# Altium project DAQ_Module.PrjPcb
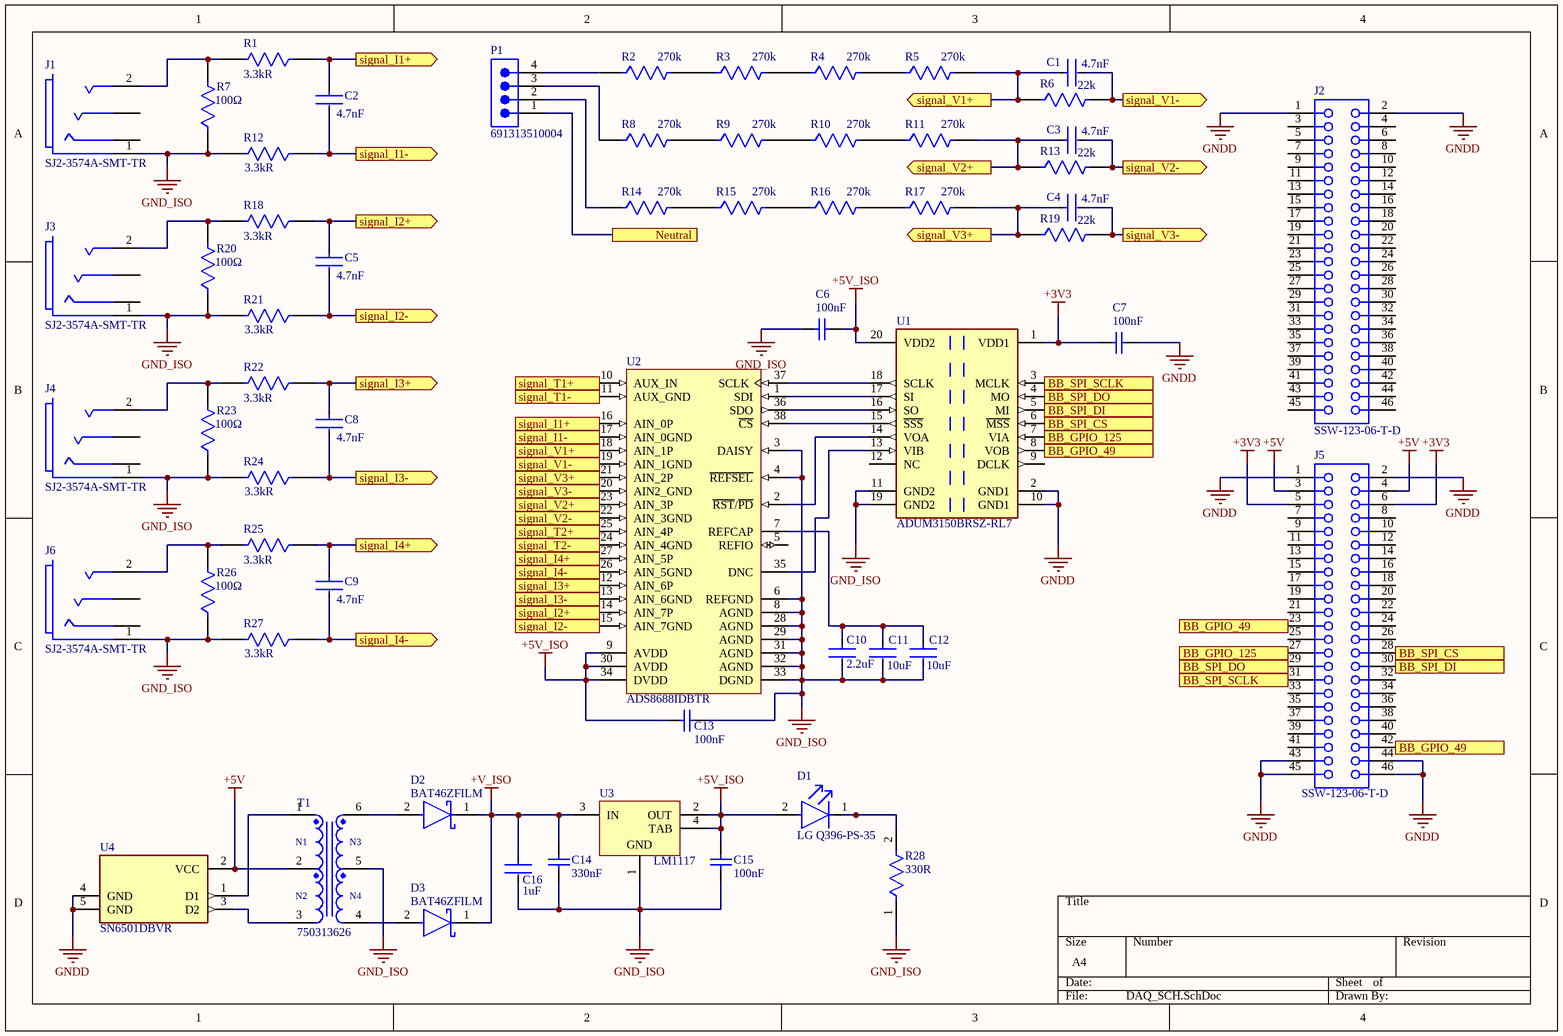
[diagram p0: DAQ_SCH.SchDoc]
Designer: Gabriel Canela; ProjectDescription: DAQ_Module for SH-Analyzer; ProjectStartDate: 06/10/2025
1 sheet, 59 parts. Net scope: flat (ports and power ports of the same name join across sheets).
Board file: DAQ_PCB.PcbDoc

## Sheet DAQ_SCH.SchDoc
size A4; SheetNumber: 1; SheetTotal: 1

### Parts
C1  Capacitance: 4.7nF  [FP-GCD188-0_1-MFG]  (hidden comment: GCD188R71H472KA01D)
C2  Capacitance: 4.7nF  [FP-GCD188-0_1-MFG]  (hidden comment: GCD188R71H472KA01D)
C3  Capacitance: 4.7nF  [FP-GCD188-0_1-MFG]  (hidden comment: GCD188R71H472KA01D)
C4  Capacitance: 4.7nF  [FP-GCD188-0_1-MFG]  (hidden comment: GCD188R71H472KA01D)
C5  Capacitance: 4.7nF  [FP-GCD188-0_1-MFG]  (hidden comment: GCD188R71H472KA01D)
C6  100nF  [CAPC2013X145X50NL20T25]
C7  100nF  [CAPC2013X145X50NL20T25]
C8  Capacitance: 4.7nF  [FP-GCD188-0_1-MFG]  (hidden comment: GCD188R71H472KA01D)
C9  Capacitance: 4.7nF  [FP-GCD188-0_1-MFG]  (hidden comment: GCD188R71H472KA01D)
C10  2.2uF  [FP-ZRB155-0_2-MFG]
C11  10uF  [FP-GRM155-0_2-MFG]
C12  10uF  [FP-GRM155-0_2-MFG]
C13  100nF  [CAPC2013X145X50NL20T25]
C14  330nF  [CAPC1608X90X35NL15T15]
C15  100nF  [CAPC2013X145X50NL20T25]
C16  1uF  [FP-CGA3E-0_3-0_1-IPC_B]
D1  LG Q396-PS-35  [FP-LG_Q396-MFG]
D2  BAT46ZFILM  [FP-SOD-123-MFG]
D3  BAT46ZFILM  [FP-SOD-123-MFG]
J1  SJ2-3574A-SMT-TR  [FP-SJ2-3574A-SMT-TR-MFG]
J2  SSW-123-06-T-D  [SMTC-SSW-123-06-X-D]
J3  SJ2-3574A-SMT-TR  [FP-SJ2-3574A-SMT-TR-MFG]
J4  SJ2-3574A-SMT-TR  [FP-SJ2-3574A-SMT-TR-MFG]
J5  SSW-123-06-T-D  [SMTC-SSW-123-06-X-D]
J6  SJ2-3574A-SMT-TR  [FP-SJ2-3574A-SMT-TR-MFG]
P1  691313510004  [691313510004]
R1  Resistance: 3.3kR  [FP-CRCW0603-HPe3-MFG]  (hidden comment: CRCW06033K30FKECHP)
R2  270k  [FP-CRGCQ1210-IPC_C]
R3  270k  [FP-CRGCQ1210-IPC_C]
R4  270k  [FP-CRGCQ1210-IPC_C]
R5  270k  [FP-CRGCQ1210-IPC_C]
R6  22k  [FP-ESR10-IPC_C]
R7  value 100Ω  [FP-CRGCQ0603-IPC_C]  (hidden comment: CRGCQ0603F100R)
R8  270k  [FP-CRGCQ1210-IPC_C]
R9  270k  [FP-CRGCQ1210-IPC_C]
R10  270k  [FP-CRGCQ1210-IPC_C]
R11  270k  [FP-CRGCQ1210-IPC_C]
R12  Resistance: 3.3kR  [FP-CRCW0603-HPe3-MFG]  (hidden comment: CRCW06033K30FKECHP)
R13  22k  [FP-ESR10-IPC_C]
R14  270k  [FP-CRGCQ1210-IPC_C]
R15  270k  [FP-CRGCQ1210-IPC_C]
R16  270k  [FP-CRGCQ1210-IPC_C]
R17  270k  [FP-CRGCQ1210-IPC_C]
R18  Resistance: 3.3kR  [FP-CRCW0603-HPe3-MFG]  (hidden comment: CRCW06033K30FKECHP)
R19  22k  [FP-ESR10-IPC_C]
R20  value 100Ω  [FP-CRGCQ0603-IPC_C]  (hidden comment: CRGCQ0603F100R)
R21  Resistance: 3.3kR  [FP-CRCW0603-HPe3-MFG]  (hidden comment: CRCW06033K30FKECHP)
R22  Resistance: 3.3kR  [FP-CRCW0603-HPe3-MFG]  (hidden comment: CRCW06033K30FKECHP)
R23  value 100Ω  [FP-CRGCQ0603-IPC_C]  (hidden comment: CRGCQ0603F100R)
R24  Resistance: 3.3kR  [FP-CRCW0603-HPe3-MFG]  (hidden comment: CRCW06033K30FKECHP)
R25  Resistance: 3.3kR  [FP-CRCW0603-HPe3-MFG]  (hidden comment: CRCW06033K30FKECHP)
R26  value 100Ω  [FP-CRGCQ0603-IPC_C]  (hidden comment: CRGCQ0603F100R)
R27  Resistance: 3.3kR  [FP-CRCW0603-HPe3-MFG]  (hidden comment: CRCW06033K30FKECHP)
R28  330R  [FP-RN731J-MFG]
T1  750313626  [WE-PPTI_1209_L12.7W9.14H7.62]
U1  ADUM3150BRSZ-RL7  [FP-RS-20-IPC_C]
U2  ADS8688IDBTR  [DBT38_N]
U3  LM1117  [DCY0004A_L]
U4  SN6501DBVR  [FP-DBV0005A-IPC_C]

### Ports
BB_GPIO_49 (out), BB_GPIO_125 (in), BB_GPIO_125 (out), BB_SPI_CS (in), BB_SPI_CS (out), BB_SPI_DI (out), BB_SPI_DO (in), BB_SPI_DO (out), BB_SPI_SCLK (in), BB_SPI_SCLK (out), Neutral, signal_I1+ (in), signal_I1+ (out), signal_I1- (in), signal_I1- (out), signal_I2+ (in), signal_I2+ (out), signal_I2- (in), signal_I2- (out), signal_I3+ (in), signal_I3+ (out), signal_I3- (in), signal_I3- (out), signal_I4+ (in), signal_I4+ (out), signal_I4- (in), signal_I4- (out), signal_T1+ (in), signal_T1- (in), signal_T2+ (in), signal_T2- (in), signal_V1+ (in), signal_V1+ (out), signal_V1- (in), signal_V1- (out), signal_V2+ (in), signal_V2+ (out), signal_V2- (in), signal_V2- (out), signal_V3+ (in), signal_V3+ (out), signal_V3- (in), signal_V3- (out)

### Nets
+3V3: C7.1 J5.5 J5.6 U1.1(VDD1)
+5V: J5.3 J5.4 T1.2 U4.2(VCC)
+5V_ISO: C6.2 C13.1 C15.2 D1.2(A) U1.20(VDD2) U2.9(AVDD) U2.30(AVDD) U2.34(DVDD) U3.2(OUT) U3.4(TAB)
+V_ISO: C14.2 C16.1 D2.1(C) D3.1(C) U3.3(IN)
GND_ISO: C6.1 C10.2 C11.2 C12.2 C13.2 C14.1 C15.1 C16.2 J1.1(sleeve) J3.1(sleeve) J4.1(sleeve) J6.1(sleeve) R7.1 R12.2 R20.1 R21.2 R23.1 R24.2 R26.1 R27.2 R28.1 T1.5 U1.11(GND2) U1.19(GND2) U2.3(DAISY) U2.4(~{REFSEL}) U2.6(REFGND) U2.8(AGND) U2.28(AGND) U2.29(AGND) U2.31(AGND) U2.32(AGND) U2.33(DGND) U3.1(GND)
GNDD: C7.2 J2.1 J2.2 J5.1 J5.2 J5.43 J5.44 J5.45 J5.46 U1.2(GND1) U1.10(GND1) U4.4(GND) U4.5(GND)
NetC1_1: C1.1 R5.2 R6.1 U2.18(AIN_1P) ; port signal_V1+
NetC1_2: C1.2 R6.2 U2.19(AIN_1GND) ; port signal_V1-
NetC2_1: C2.1 R1.1 U2.16(AIN_0P) ; port signal_I1+
NetC2_2: C2.2 R12.1 U2.17(AIN_0GND) ; port signal_I1-
NetC3_1: C3.1 R11.2 R13.1 U2.23(AIN_3P) ; port signal_V2+
NetC3_2: C3.2 R13.2 U2.22(AIN_3GND) ; port signal_V2-
NetC4_1: C4.1 R17.2 R19.1 U2.21(AIN_2P) ; port signal_V3+
NetC4_2: C4.2 R19.2 U2.20(AIN2_GND) ; port signal_V3-
NetC5_1: C5.1 R18.1 U2.14(AIN_7P) ; port signal_I2+
NetC5_2: C5.2 R21.1 U2.15(AIN_7GND) ; port signal_I2-
NetC8_1: C8.1 R22.1 U2.12(AIN_6P) ; port signal_I3+
NetC8_2: C8.2 R24.1 U2.13(AIN_6GND) ; port signal_I3-
NetC9_1: C9.1 R25.1 U2.27(AIN_5P) ; port signal_I4+
NetC9_2: C9.2 R27.1 U2.26(AIN_5GND) ; port signal_I4-
NetC10_1: C10.1 C11.1 C12.1 U2.7(REFCAP)
NetD1_1: D1.1(C) R28.2
NetD2_2: D2.2(A) T1.6
NetD3_2: D3.2(A) T1.4
NetJ1_2: J1.2(tip) R1.2 R7.2
NetJ3_2: J3.2(tip) R18.2 R20.2
NetJ4_2: J4.2(tip) R22.2 R23.2
NetJ5_23: J5.23 J5.42 U1.8(VOB) ; port BB_GPIO_49
NetJ5_27: J5.27 U1.7(VIA) ; port BB_GPIO_125
NetJ5_28: J5.28 U1.6(~{MSS}) ; port BB_SPI_CS
NetJ5_29: J5.29 U1.4(MO) ; port BB_SPI_DO
NetJ5_30: J5.30 U1.5(MI) ; port BB_SPI_DI
NetJ5_31: J5.31 U1.3(MCLK) ; port BB_SPI_SCLK
NetJ6_2: J6.2(tip) R25.2 R26.2
NetP1_1: P1.1 ; port Neutral
NetP1_2: P1.2 R14.1
NetP1_3: P1.3 R8.1
NetP1_4: P1.4 R2.1
NetR2_2: R2.2 R3.1
NetR3_2: R3.2 R4.1
NetR4_2: R4.2 R5.1
NetR8_2: R8.2 R9.1
NetR9_2: R9.2 R10.1
NetR10_2: R10.2 R11.1
NetR14_2: R14.2 R15.1
NetR15_2: R15.2 R16.1
NetR16_2: R16.2 R17.1
NetT1_1: T1.1 U4.1(D1)
NetT1_3: T1.3 U4.3(D2)
NetU1_13: U1.13(VIB) U2.35(DNC)
NetU1_14: U1.14(VOA) U2.2(~{RST}/~{PD})
NetU1_15: U1.15(~{SSS}) U2.38(~{CS})
NetU1_16: U1.16(SO) U2.36(SDO)
NetU1_17: U1.17(SI) U2.1(SDI)
NetU1_18: U1.18(SCLK) U2.37(SCLK)
NetU2_10: U2.10(AUX_IN) ; port signal_T1+
NetU2_11: U2.11(AUX_GND) ; port signal_T1-
NetU2_24: U2.24(AIN_4GND) ; port signal_T2-
NetU2_25: U2.25(AIN_4P) ; port signal_T2+

Not connected (* = marked no-connect by the designer): J1 3(ring_1) 4(ring_2); J2 3 4 5 6 7 8 9 10 11 12 13 14 15 16 17 18 19 20 21 22 23 24 25 26 27 28 29 30 31 32 33 34 35 36 37 38 39 40 41 42 43 44 45 46; J3 3(ring_1) 4(ring_2); J4 3(ring_1) 4(ring_2); J5 7 8 9 10 11 12 13 14 15 16 17 18 19 20 21 22 24 25 26 32 33 34 35 36 37 38 39 40 41; J6 3(ring_1) 4(ring_2); U1 9(DCLK) 12(NC); U2 5(REFIO)

### Notes on the sheet
- (in symbol CMP-03913-34483586-1) N1; N3; N2; N4

### Library data of the parts
C1-C5 C8 C9 = CMP-06035-049634-1: Chip Multilayer Ceramic Capacitors for Automotive, 0603, 4700pF, X7R, 15%, 10%, 50V, Grade 1; Height: 0.8mm; Case Code (Imperial): 0603; Ratings: AEC-Q200; Width: 0.8mm; Packaging: Tape and Reel; Tolerance: 10%; Max Operating Temperature: 125°C; Package Quantity: 4000; Weight: 0.000222oz; Termination: SMD/SMT; Voltage Rating (DC): 50V; Thickness: 0.031inch; Voltage Rating: 50V; Case Code (Metric): 1608; Dielectric: X7R; Length: 0.063inch; Min Operating Temperature: -55°C; Mount: Surface Mount; Case/Package: 0603
C6 C7 C13 C15 = CMP-2007-01227-1: Manufacturer: Kemet; Part Number: C0805S104K5RACTU
C10 = CMP-06035-063357-1: Low Acoustic Noise Chip Multilayer Ceramic Capacitors on Interposer Board for General Purpose ZRB Series 0402 Package X5R @ 15% 25Vdc 2.2uF @ 20%
C11 C12 = CMP-00260-135863761-1: GRM155D70G106ME18D SMD Chip Multilayer Ceramic Capacitor; Voltage Rating (DC): 4V; Dielectric: X7T; Capacitance: 10µF; Thickness: 500µm; Lifecycle Status: Production; Width: 500µm; Case/Package: 0402; NexarPartId: 135863761; Length: 1mm
C14 = CMP-1035-02674-2: Part Number: 06033D334KAT2A; Manufacturer: AVX Interconnect / Elco
C16 = CMP-08246-001878-1: Cap Ceramic 1uF 25V X7R 20% Pad SMD 0603 +125°C Automotive T/R; Case Code (Metric): 1608; Case Code (Imperial): 0603; Dielectric: X7R; Voltage Rating (DC): 25V; Max Operating Temperature: 125°C; Weight: 7.1E-05oz; Height: 0.8mm; Thickness: 0.031inch; Voltage Rating: 25V; Ratings: AEC-Q200; Mount: Surface Mount; Package Quantity: 4000; Min Operating Temperature: -55°C; Length: 0.063inch; Packaging: Tape and Reel; Tolerance: 20%; Case/Package: 0603; Width: 0.031inch; Capacitance: 1uF
D1 = CMP-62016-000069-1: LED GREEN DIFFUSED 0603 SMD; Lens Color: White; Wavelength: 573nm; Test Current: 20mA; Luminous Intensity: 163mcd; Lens Style: Flat; Lens Size: 0.8mm; Forward Voltage: 2V; Viewing Angle: 120°; Height: 0.4mm; Color: Green; Mount: Surface Mount; Case Code (Metric): 1608; Lens Transparency: Diffused; REACH SVHC: No SVHC; Length: 1.6mm; Width: 0.8mm; Dominant Wavelength: 573nm; RoHS Compliant: Yes; Case/Package: 0603; Case Code (Imperial): 0603; Packaging: Tape and Reel; Forward Current: 20mA
D2 D3 = CMP-12187-000006-1: DIODE SCHOTTKY 100V 150MA SOD123; Manufacturer: STMicroelectronics; Max Surge Forward Current: 1A; Capacitance: 10pF; Standoff Height: 0mm; Peak Reverse Current: 5uA; Value: 10pF; Max Junction Temp: +150°C; Automotive: No; Ipc Land Pattern Name: SOD375155X145-2; Device Class L2: Diodes; Device Class L1: Discrete Semiconductors; Temperature Range High: +150°C; ComponentLink2Description: Datasheet; Lead Free: Yes; Digikey Description: DIODE SCHOTTKY 100V 150MA SOD123; RoHS: TRUE; Category: Diode; Max Repetitive Reverse Voltage: 100V; ComponentLink2URL: https://www.st.com/resource/en/datasheet/bat46.pdf; Manufacturer Part Number: BAT46ZFILM; Temperature: to +150°C; Mouser Description: Schottky Diodes & Rectifiers schottky diode; Package: SOD-123; Forward Current: 150mA; Octopart: https://octopart.com/bat46zfilm-stmicroelectronics-658190; Height: 1.45mm; Device Class L3: Schottky Diodes
J1 J3 J4 J6 = CMP-14818-000001-1: AUDIO JACK, 3.5 MM, RT, 4 CONDUC; Manufacturer: CUI; Conn Orientation: Horizontal; Current Rating: 1A; Number Of Contacts: 4; Voltage Rating: 12V; Package: SJ2-3574A-SMT-TR; Device Class L1: Connectors; Lead Free: Yes; Digikey Description: AUDIO JACK, 3.5 MM, RT, 4 CONDUC; Device Class L2: Audio / Video Connectors; ComponentLink2URL: https://www.cui.com/product/resource/sj2-357x-smt.pdf; Automotive: No; RoHS: TRUE; Height: 5.3mm; Temperature Range Low: -25°C; Category: Conn; Temperature: -25°C to +85°C; Octopart: https://octopart.com/sj2-3574a-smt-tr-cui-77838840; Device Class L3: unset; Contact Material: Silver; Manufacturer Part Number: SJ2-3574A-SMT-TR; Temperature Range High: +85°C; ComponentLink2Description: Datasheet
J2 J5 = CMP-1023-00471-1: SQ Post Socket, Through-hole, Vertical, -55 to 105 degC, 2.54 mm Pitch, 46-Pin, Female, RoHS; Manufacturer: Samtec; Pitch: 2.54 mm; Mounting Technology: Through-hole; PartNumber: SSW-123-06-T-D; ComponentLink1URL: http://www.samtec.com; Temperature Range: -55 to 105 degC; ComponentLink1Description: Manufacturer URL; PackageDescription: Assembly, Socket Strip .016 X .031 Tail; DatasheetVersion: F-214; RoHS: True; ComponentLink2Description: Datasheet; PackageReference: SSW-123-06-X-D; PackageVersion: CA, 6/1987; Orientation: Vertical; ComponentLink3Description: Package Specification; ComponentLink3URL: http://www.samtec.com/documents/webfiles/cpdf/SSW-1XX-XX-XXX-X-XX-XXX-XX-MKT.pdf; ComponentLink2URL: http://www.samtec.com/documents/webfiles/pdf/SSW_TH.PDF
P1 = CMP-1502-02194-2: NexarPartId: 8917761; Number of Positions Per Level: 4; Pitch: 5.08mm; Gender: Male; Number of Levels: 1; Current: 20A; Voltage: 300V; Contact Material: Brass; Length: 11.5mm; Number of Contacts: 4; Termination: Solder; REACH SVHC: Unknown; Lead Pitch: 5.08mm; Packaging: Box; RoHS: Compliant; Width: 22.32mm; Mount: Through Hole; Number of Rows: 1; Number of Pins: 4; Color: Green; Height: 12mm; Contact Plating: Tin
R1 R12 R18 R21 R22 R24 R25 R27 = CMP-02407-003357-1: RES Thick Film, 3.3kΩ, 1%, 0.33W, 100ppm/°C, 0603; Power Rating: 100mW; Case/Package: 0603; Lead Free: Lead Free; Tolerance: 1%
R2-R5 R8-R11 R14-R17 = CMP-03211-000064-1: CRGCQ1210 270KΩ 0.5W ±100ppm/°C 1% 200V; Manufacturer: TE Connectivity; Manufacturer Part Number: CRGCQ1210F270K; Tolerance: 0.01; Device Class L1: Passive Components; Device Class L3: Chip SMD Resistors; Series: CRGCQ; Composition: Thick Film; Temperature Range High: +155°C; Temperature: -55°C to +155°C; Voltage Rating: 200V; Value: 270KΩ; ComponentLink2Description: Datasheet; Ambient Temperature Range High: +70°C; Temperature Coefficient: ±100ppm/°C; Power Rating: 0.5W; RoHS: TRUE; Temperature Range Low: -55°C; Ipc Land Pattern Name: RESC310260X55; Height: 0.65mm; Category: Res; Octopart: https://octopart.com/crgcq1210f270k-te+connectivity-91018371; Device Class L2: Resistors; Resistance: 270KΩ; Lead Free: Yes; Package: CRGCQ1210; ComponentLink2URL: https://www.te.com/commerce/DocumentDelivery/DDEController?Action=showdoc&DocId=Data+Sheet%7F1773204-3%7F1%7Fpdf%7FEnglish%7FENG_DS_1773204-3_1.pdf%7F4-2176347-1244; Automotive: Yes; Automotive Grade: Grade 1235
R6 R13 R19 = CMP-08839-028387-1: 22kΩ ±1% 0.4W 0805 Anti-Surge Chip Resistor AEC-Q200; Max Power Dissipation: 400mW; Temperature Coefficient: 100ppm/°C; Resistance: 22kR; Packaging: Tape and Reel; Number of Terminations: 2; Tolerance: 1%; RoHS Compliant: Yes; Case/Package: 0805; Series: ESR10; Max Operating Temperature: 155°C; Width: 0.049inch; Features: Automotive AEC-Q200; Length: 0.079inch; Resistor Type: Thick Film; Min Operating Temperature: -55°C; Height: 0.026inch; Package Quantity: 5000
R7 R20 R23 R26 = CMP-03211-002191-1: CRGCQ0603 100Ω 1% ±200ppm/°C 75V; Manufacturer: TE Connectivity; Tolerance: 0.01; Power Rating: 0.1W; Octopart: https://octopart.com/crgcq0603f100r-te+connectivity-91018035; Device Class L1: Passive Components; Ipc Land Pattern Name: RESC16080X45; Voltage Rating: 75V; Temperature Range High: +155°C; Height: 0.55mm; Device Class L2: Resistors; Temperature: -55°C to +155°C; RoHS: TRUE; ComponentLink2URL: https://www.te.com/commerce/DocumentDelivery/DDEController?Action=showdoc&DocId=Data+Sheet%7F1773204-3%7F1%7Fpdf%7FEnglish%7FENG_DS_1773204-3_1.pdf%7F4-2176339-466; Package: CRGCQ0603; Resistance: 100Ω; Ambient Temperature Range High: +70°C; Composition: Thick Film; Device Class L3: Chip SMD Resistors; Temperature Range Low: -55°C; Series: CRGCQ; Category: Res; Manufacturer Part Number: CRGCQ0603F100R; ComponentLink2Description: Datasheet; Temperature Coefficient: ±200ppm/°C; Lead Free: Yes
R28 = CMP-03211-003888-1: Thin Film Resistors RN 0603 330Ω 0.1% 10ppm/°C; Manufacturer: TE Connectivity; Manufacturer Part Number: RN73C1J330RBTDF; Voltage Rating: 50V; Power Rating: 0.063W; Temperature Range Low: -55°C; Automotive: No; Series: RN73; Ipc Land Pattern Name: RESC15580X45; packaging: 1000 Reel; Tolerance: 0.1%; Resistance: 330Ω; Temperature: -55°C to +155°C; ComponentLink2URL: https://www.te.com/commerce/DocumentDelivery/DDEController?Action=showdoc&DocId=Data+Sheet%7F1773270%7FP%7Fpdf%7FEnglish%7FENG_DS_1773270_P.pdf%7F9-1614352-9; Device Class L1: Passive Components; Temperature Range High: +155°C; ComponentLink2Description: Datasheet; Octopart: https://octopart.com/rn73c1j330rbtdf-te+connectivity-22740699; Device Class L2: Resistors; Category: Res; Height: 0.55mm; Device Class L3: Chip SMD Resistors; Temperature Coefficient: 10ppm/°C; octopart_url: https://octopart.com/rn73c1j330rbtdf-te+connectivity-22740699; Package: RN731J; Value: 330Ω; Composition: Thin Film; RoHS: TRUE; Lead Free: Yes
T1 = CMP-03913-34483586-1: 750313626 TRANSFORMER, AEC-Q200, 1: 2, 340UH, SMT; Inductance: 340µH; Product Range: MID-PPTI Series; SVHC: No SVHC (15-Jan-2019); DC Resistance (DCR): 581mΩ; Turns Ratio: 1:2; Isolation Voltage: 5kV; Shielding: Unshielded; Current Rating: 150mA; NexarPartId: 34483586; Length: 9.14mm; Mount: Surface Mount; RoHS: Compliant; Width: 8mm; Height: 7.62mm; Min Operating Temperature: -40°C; Case/Package: SMD/SMT; Termination: SMD/SMT; Max Operating Temperature: 125°C; Packaging: Tape & Reel (TR); Height - Seated (Max): 7.62mm
U1 = CMP-09093-000021-1: DGT ISOL 3750VRMS 6CH SPI 20SSOP; Turn-On Delay Time: 14ns; Pulse Width Distortion (PWD): 2ns; Polarity: Bidirectional; Number of Channels: 6; Min Supply Voltage: 3V; Isolated Power: No; Data Rate: 80Mbps; Channel Type: Unidirectional; Max Supply Voltage: 5.5V; Isolation Voltage: 3.75kV; Contact Plating: Tin; Package Quantity: 500; Max Operating Temperature: 125°C; Lead Free: Contains Lead; Case/Package: SSOP; Number of Pins: 20; Min Operating Temperature: -40°C; RoHS Compliant: Yes; Mount: Surface Mount; Propagation Delay: 14ns; Packaging: Tape and Reel; Weight: 0.016oz
U2 = CMP-0003-02189-1: Single-Supply, SAR ADCs with Bipolar Input Ranges, 16 Bits, 500 kSPS, 8 Channel, -40 to 125 degC, 38-Pin TSSOP (DBT), Green (RoHS & no Sb/Br), Tape and Reel; Manufacturer: Texas Instruments; THD: -102 dB; SNR: 92 dB; AVDD: 4.75 to 5.25 V; Input Channel: 8; Resolution: 16 Bits; Eco-Plan: Green (RoHS & no Sb/Br); Temperature Range: -40 to 125 degC; Mounting Technology: Surface Mount; DatasheetVersion: SBAS582B; Packing: Tape and Reel; PackageVersion: 4073252-6/I; Sample Rate: 500 kSPS; PartNumber: ADS8688IDBTR; ComponentLink2Description: Datasheet; ComponentLink3Description: Package Specification; ComponentLink3URL: http://www.ti.com/lit/ml/mpds368/mpds368.pdf; ComponentLink1Description: Manufacturer URL; ComponentLink2URL: http://www.ti.com/lit/ds/symlink/ads8688.pdf; PackageDescription: 38-Pin Plastic Small Outline Package, Body 9.7 x 4.4 mm, Pitch 0.5 mm; ComponentLink1URL: www.ti.com
U3 = CMP-0062-01635-4: 800mA Low-Dropout Linear Regulator, 4-pin SOT-223, Pb-Free; PartNumber: LM1117MPX-5.0/NOPB; Manufacturer: Texas Instruments; PowerWise: N; High-Reliability: Y; PackageTopMarking: XYTT*N06A; CompType: LDO IC; Code_JEDEC: TO-261-AA; Code_IPC: SOT223-4; ComponentLink1URL: http://www.ti.com/general/docs/lit/getliterature.tsp?genericPartNumber=LM1117-N&fileType=pdf; PinCount: 4; PackageReference: DCY0004A; ComponentLink1Description: Datasheet URL; PackageDescription: Molded SOT-223, 6.50 x 3.56 x 1.6mm Body, 4 Lead, 2.3mm Pitch; RoHS: Y
U4 = CMP-2000-07129-2: IC REG CONV PWR SUPPLIES SOT23-5; Output Voltage: 11V; Number of Outputs: 1; Min Supply Voltage: 3V; Max Supply Voltage: 5.5V; Max Output Current: 350mA; Output Type: Adjustable; Switching Frequency: 620kHz; Operating Supply Current: 300uA; Output Current: 250mA; Mount: Surface Mount; Contact Plating: Tin; Packaging: Tape and Reel; Max Operating Temperature: 125°C; Package Quantity: 3000; Lead Free: Lead Free; Case/Package: SOT-23-5; Min Operating Temperature: -40°C; REACH SVHC: No SVHC; Max Input Voltage: 5.5V; Number of Pins: 5; Min Input Voltage: 3V